# Altium schematic sheet Serial Microcontroller.SchDoc
size A; Organization: Underwater Robotics; Address1: c/o Student Involvement; Address2: Campus Box 7306; Address3: 2016 Cates Ave. Raleigh, NC 27695; Revision: A1; SheetNumber: 2D; SheetTotal: 4D
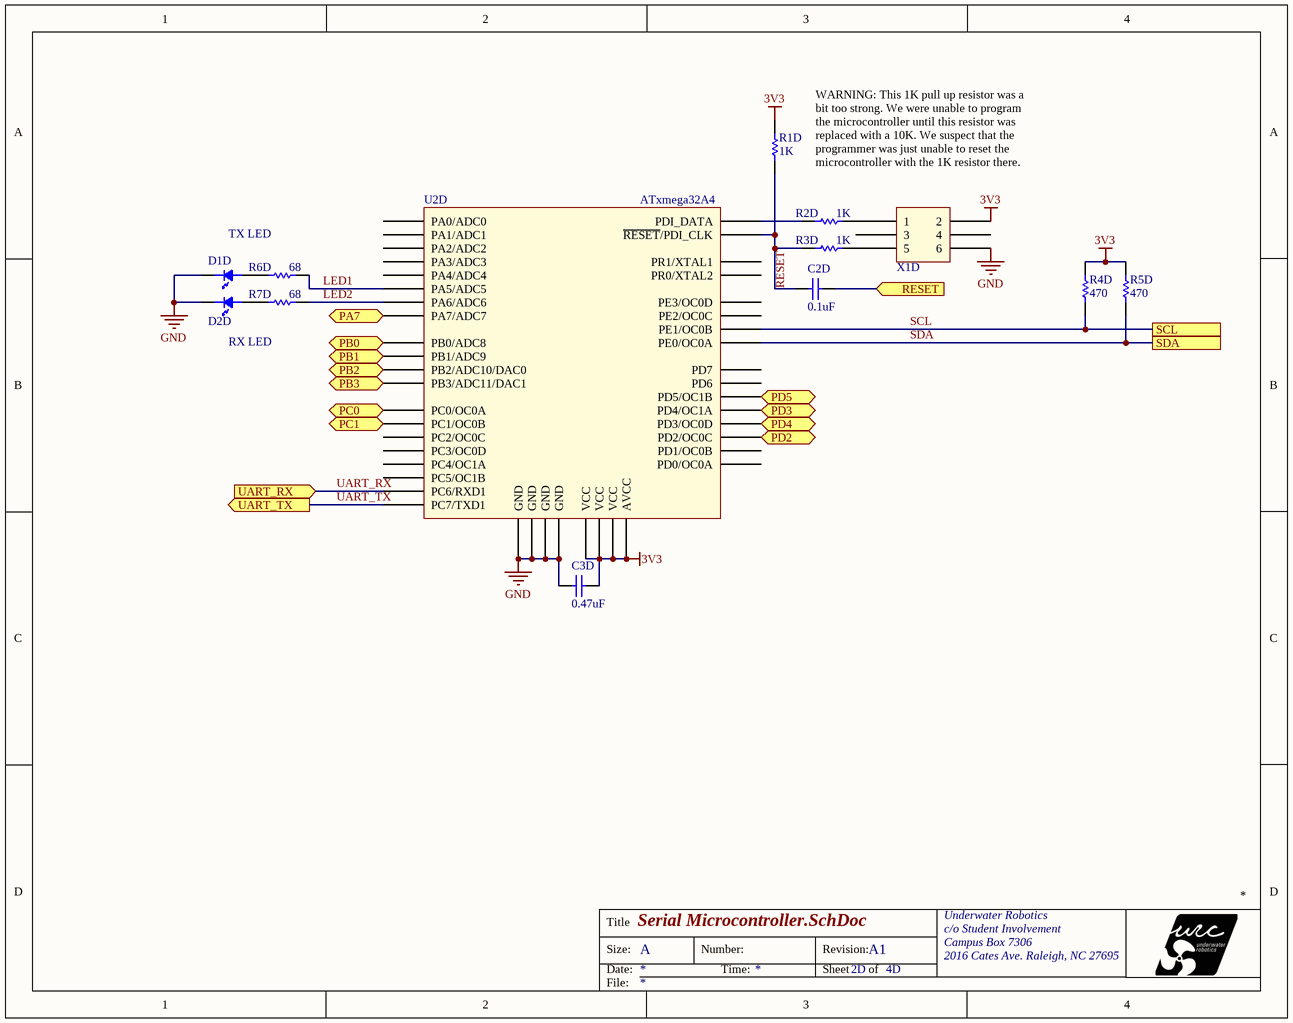
[diagram p0: Serial Microcontroller.SchDoc]

## Parts
C2D  value 0.1uF  [C0805]  (hidden comment: Cap)
C3D  value 0.47uF  [C0805]  (hidden comment: Cap)
D1D  LED  [LED0805]  (value not drawn)
D2D  LED  [LED0805]  (value not drawn)
R1D  value 1K  [R0805]  (hidden comment: Resistor)
R2D  value 1K  [R0805]  (hidden comment: Resistor)
R3D  value 1K  [R0805]  (hidden comment: Resistor)
R4D  value 470  [R0805]  (hidden comment: Resistor)
R5D  value 470  [R0805]  (hidden comment: Resistor)
R6D  value 68  [R0805]  (hidden comment: Resistor)
R7D  value 68  [R0805]  (hidden comment: Resistor)
U2D  ATxmega32A4  [ATxmegaA4-TQFP44]
X1D  Header  [2x3 Header]  (value not drawn)

## Ports
PA7 (bidir), PB0 (bidir), PB1 (bidir), PB2 (bidir), PB3 (bidir), PC0 (bidir), PC1 (bidir), PD2 (bidir), PD3 (bidir), PD4 (bidir), PD5 (bidir), RESET (in), SCL, SDA, UART_RX (in), UART_TX (out)

## Nets
3V3: C3D.2 R1D.2 R4D.2 R5D.2 U2D.9(VCC) U2D.19(VCC) U2D.31(VCC) U2D.39(AVCC) X1D.2
GND: C3D.1 D1D.1 D2D.1 U2D.8(GND) U2D.18(GND) U2D.30(GND) U2D.38(GND) X1D.6
LED1: R6D.2 U2D.1(PA5/ADC5)
LED2: R7D.2 U2D.2(PA6/ADC6)
PA7: U2D.3(PA7/ADC7) ; port PA7
PB0: U2D.4(PB0/ADC8) ; port PB0
PB1: U2D.5(PB1/ADC9) ; port PB1
PB2: U2D.6(PB2/ADC10/DAC0) ; port PB2
PB3: U2D.7(PB3/ADC11/DAC1) ; port PB3
PC0: U2D.10(PC0/OC0A) ; port PC0
PC1: U2D.11(PC1/OC0B) ; port PC1
PD2: U2D.22(PD2/OC0C) ; port PD2
PD3: U2D.24(PD4/OC1A) ; port PD3
PD4: U2D.23(PD3/OC0D) ; port PD4
PD5: U2D.25(PD5/OC1B) ; port PD5
RESET: C2D.2 R1D.1 R3D.1 U2D.35(~{RESET}/PDI_CLK)
RESET: C2D.1 ; port RESET  [a separate net that carries the same name]
SCL: R4D.1 U2D.29(PE1/OC0B) ; port SCL
SDA: R5D.1 U2D.28(PE0/OC0A) ; port SDA
UART_RX: U2D.16(PC6/RXD1) ; port UART_RX
UART_TX: U2D.17(PC7/TXD1) ; port UART_TX
NetD1D_2: D1D.2 R6D.1
NetD2D_2: D2D.2 R7D.1
NetR2D_1: R2D.1 U2D.34(PDI_DATA)
NetR2D_2: R2D.2 X1D.1
NetR3D_2: R3D.2 X1D.5

Not connected (* = marked no-connect by the designer): U2D 12(PC2/OC0C) 13(PC3/OC0D) 14(PC4/OC1A) 15(PC5/OC1B) 20(PD0/OC0A) 21(PD1/OC0B) 26(PD6) 27(PD7) 32(PE2/OC0C) 33(PE3/OC0D) 36(PR0/XTAL2) 37(PR1/XTAL1) 40(PA0/ADC0) 41(PA1/ADC1) 42(PA2/ADC2) 43(PA3/ADC3) 44(PA4/ADC4); X1D 3 4

## Notes on the sheet
- TX LED
- WARNING: This 1K pull up resistor was a bit too strong. We were unable to program the microcontroller until this resistor was replaced with a 10K. We suspect that the programmer was just unable to reset the microcontroller with the 1K resistor there.
- RX LED
- Title
- Size:
- Date:
- A
- Number:
- Time:
- Revision:
- Sheet
- of
- File:

## Library data of the parts
C2D C3D = Cap: Unpolarized Capacitor
R1D R2D R3D R4D R5D R6D R7D = Res: Tolerance: 5%
U2D = ATxmegaA4: Manufacturer 1: ATMEL; Manufacturer Part Number: ATXMEGA32A4-AU; Description 1: ATMEL - ATXMEGA32A4-AU - MICROCONTROLLER MCU, 8 BIT, AVR XMEGA, 32MHZ, TQFP-44; CPU Speed: 32; RAM Memory Size: 4; No. of Pins: 44; MCU Case Style: TQFP; No. of I/O's: 34; Supply Voltage Min: 1.6; Supplier 1: Newark; Supplier Part Number 1: 68T3938; RoHS: YES; Stock 1: 376; Pricing 1: 1=6.13, 10=5.5, 25=5.01, 50=4.54, 100=4.24, 250=4.11, 500=3.8, 1000=3.53 (USD); Controller Family/Series: ATxmega; Program Memory Size: 32; ComponentLink1URL: http://www.farnell.com/datasheets/1734580.pdf; ComponentLink1Description: http://www.farnell.com/datasheets/1734580.pdf; ComponentLink2URL: http://www.farnell.com/cad/1773773.zip; ComponentLink2Description: http://www.farnell.com/cad/1773773.zip; ComponentLink3URL: http://bcove.me/gu8hm7kh; ComponentLink3Description: http://bcove.me/gu8hm7kh
X1D = 2x3 Header: Manufacturer 1: FCI; Manufacturer Part Number: 67996-406HLF; Description 1: FCI - 67996-406HLF - BOARD-BOARD CONNECTOR HEADER, 6 POSITION, 2ROW; Product Range: BergStik 67996 Series; Contact Termination Type: Through Hole; No. of Contacts: 6; Pitch Spacing: 2.54; No. of Rows: 2; Supplier Part Number 1: 20M2191; Supplier 1: Newark; RoHS: YES; Stock 1: 441; Pricing 1: 1=0.254, 10=0.218, 25=0.186, 50=0.178, 100=0.16, 250=0.153, 500=0.128, 1000=0.117 (USD); Gender: Header; Contact Plating: Tin Plated Contacts; ComponentLink1URL: http://www.farnell.com/datasheets/1876884.pdf; ComponentLink1Description: http://www.farnell.com/datasheets/1876884.pdf